# EAGLE design sonoff DIY, 3 gang(Dip version-V.1.1) (EAGLE 9.6.2)
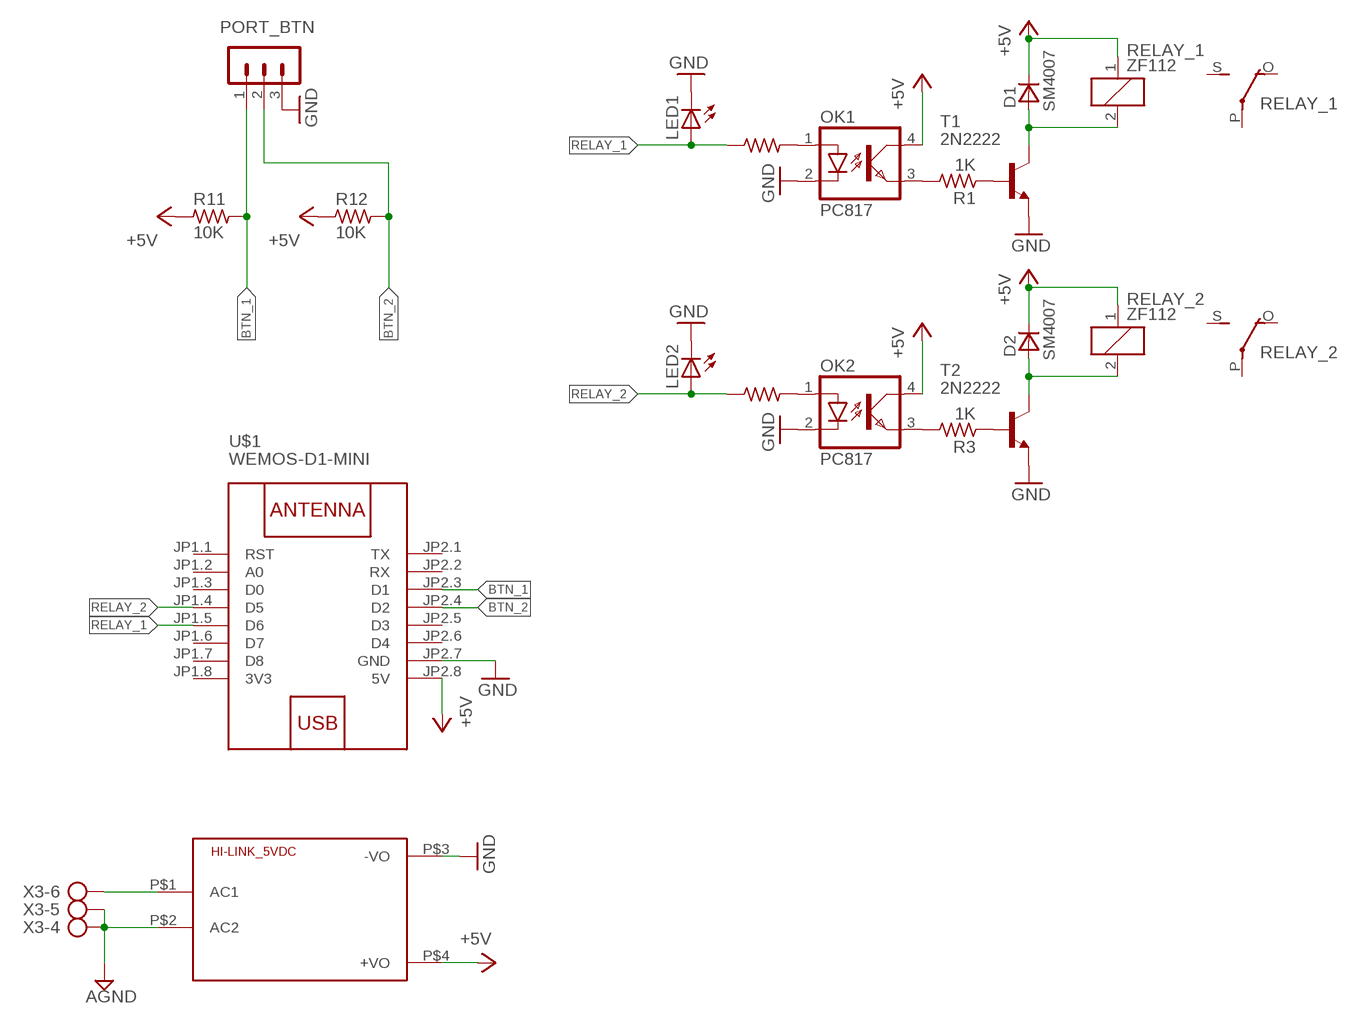
[diagram p0: schematic, sheet 1]

## Parts
D1  SM4007  [MELF-MLL41]
D2  SM4007  [MELF-MLL41]
HI-LINK_5VDC  HLK-PM013W  [HLK-PM01]
LED1  LED3MM  [LED3MM]
LED2  LED3MM  [LED3MM]
OK1  PC817  [DIL04]
OK2  PC817  [DIL04]
PORT_BTN  MA03-1  [MA03-1]
R1  1K  R_0805  [R0805]
R2  1K  R_0805  [R0805]
R3  1K  R_0805  [R0805]
R4  1K  R_0805  [R0805]
R11  10K  R_0805  [R0805]
R12  10K  R_0805  [R0805]
RELAY_1  ZF112  [ZF112]
RELAY_2  ZF112  [ZF112]
T1  2N2222  [TO18]
T2  2N2222  [TO18]
U$1  WEMOS-D1-MINI  [WEMOS-D1-MINI]
X3  SMKDSP_1,5/6  [SMKDSP_1,5/6]

## Nets
+5V: D1.C D2.C HI-LINK_5VDC.P$4(+VO) OK1.4(COL) OK2.4(COL) R11.1 R12.1 RELAY_1.1 RELAY_2.1 U$1.JP2.8(5V)
AGND: HI-LINK_5VDC.P$2(AC2) X3.4 X3.5
BTN_1: PORT_BTN.1 R11.2 U$1.JP2.3(D1)
BTN_2: PORT_BTN.2 R12.2 U$1.JP2.4(D2)
GND: HI-LINK_5VDC.P$3(-VO) LED1.K(C) LED2.K(C) OK1.2(C) OK2.2(C) PORT_BTN.3 T1.1(E) T2.1(E) U$1.JP2.7(GND)
N$1: OK1.1(A) R2.1
N$2: OK1.3(EMIT) R1.2
N$3: R1.1 T1.2(B)
N$4: D1.A RELAY_1.2 T1.3(C)
N$6: OK2.1(A) R4.1
N$7: HI-LINK_5VDC.P$1(AC1) X3.6
N$8: OK2.3(EMIT) R3.2
N$9: R3.1 T2.2(B)
N$10: D2.A RELAY_2.2 T2.3(C)
RELAY_1: LED1.A R2.2 U$1.JP1.5(D6)
RELAY_2: LED2.A R4.2 U$1.JP1.4(D5)
Unconnected: RELAY_1.O(2:O) RELAY_1.P(2:P) RELAY_1.S(2:S) RELAY_2.O(2:O) RELAY_2.P(2:P) RELAY_2.S(2:S) U$1.JP1.1(RST) U$1.JP1.2(A0) U$1.JP1.3(D0) U$1.JP1.6(D7) U$1.JP1.7(D8) U$1.JP2.1(TX) U$1.JP2.2(RX) U$1.JP2.5(D3) U$1.JP2.6(D4) X3.1 X3.2 X3.3

## Power pins joined to a net without a drawn wire
3V3: U$1.JP1.8(3V3)

## Library data of the parts
D1 D2 = _mod_diode:SM400*: SM4001 .. SM4007 General Purpose Rectifier, 1 A SMD-Version of 1N4001 .. 1N4007 Case: MELF-MLL41 = DO 213 AB Author: Dipl.-Ing. FH Rainer Bayer HHN Hochschule Heilbronn, rainer.bayer@hs-heilbronn.de Ingenieurbüro ing-rb, mail@ing-rb.de
HI-LINK_5VDC = HLK-PM01:HLK-PM01: Hi-Link Power Supply HLK-PM01 3W Author: Ahmed Said <https://github.com/AhmedSaid/EAGLELibraries>
LED1 LED2 = led:LED: LED OSRAM: - CHIPLED LG R971, LG N971, LY N971, LG Q971, LY Q971, LO R971, LY R971 LH N974, LH R974 LS Q976, LO Q976, LY Q976 LO Q996 - Hyper CHIPLED LW Q18S LB Q993, LB Q99A, LB R99A - SideLED LS A670, LO A670, LY A670, LG A670, LP A670 LB A673, LV A673, LT A673, LW A673 LH A674 LY A675 LS A676, LA A676, LO A676, LY A676, LW A676 LS A679, LY A679, LG A679 - Hyper Micro SIDELED® LS Y876, LA Y876, LO Y876, LY Y876 LT Y87S - SmartLED LW L88C, LW L88S LB L89C, LB L89S, LG L890 LS L89K, LO L89K, LY L89K LS L896, LA L896, LO L896, LY L896 - TOPLED LS T670, LO T670, LY T670, LG T670, LP T670 LSG T670, LSP T670, LSY T670, LOP T670, LYG T670 LG T671, LOG T671, LSG T671 LB T673, LV T673, LT T673, LW T673 LH T674 LS T676, LA T676, LO T676, LY T676, LB T676, LH T676, LSB T676, LW T676 LB T67C, LV T67C, LT T67C, LS T67K, LO T67K, LY T67K, LW E67C LS E67B, LA E67B, LO E67B, LY E67B, LB E67C, LV E67C, LT E67C LW T67C LS T679, LY T679, LG T679 LS T770, LO T770, LY T770, LG T770, LP T770 LB T773, LV T773, LT T773, LW T773 LH T774 LS E675, LA E675, LY E675, LS T675 LS T776, LA T776, LO T776, LY T776, LB T776 LHGB T686 LT T68C, LB T68C - Hyper Mini TOPLED® LB M676 - Mini TOPLED Santana® LG M470 LS M47K, LO M47K, LY M47K Source: http://www.osram.convergy.de LUXEON: - LUMILED® LXK2-PW12-R00, LXK2-PW12-S00, LXK2-PW14-U00, LXK2-PW14-V00 LXK2-PM12-R00, LXK2-PM12-S00, LXK2-PM14-U00 LXK2-PE12-Q00, LXK2-PE12-R00, LXK2-PE12-S00, LXK2-PE14-T00, LXK2-PE14-U00 LXK2-PB12-K00, LXK2-PB12-L00, LXK2-PB12-M00, LXK2-PB14-N00, LXK2-PB14-P00, LXK2-PB14-Q00 LXK2-PR12-L00, LXK2-PR12-M00, LXK2-PR14-Q00, LXK2-PR14-R00 LXK2-PD12-Q00, LXK2-PD12-R00, LXK2-PD12-S00 LXK2-PH12-R00, LXK2-PH12-S00 LXK2-PL12-P00, LXK2-PL12-Q00, LXK2-PL12-R00 Source: www.luxeon.com KINGBRIGHT: KA-3528ASYC Source: www.kingbright.com
OK1 OK2 = optocoupler:PC817: SHARP OPTO COUPLER; MPN: PC817X4J000F; OC_FARNELL: 9707727; OC_NEWARK: 97K7059
PORT_BTN = con-lstb:MA03-1: PIN HEADER; OC_FARNELL: unknown; OC_NEWARK: unknown
R1-R4 R11 R12 = rc-master-smd:R_: RESISTOR
RELAY_1 RELAY_2 = relay:ZF112: RELAY 1 x switch; OC_FARNELL: unknown; OC_NEWARK: unknown
T1 T2 = transistor:2N2222: NPN TRANSISTOR
U$1 = diy-modules:WEMOS-D1-MINI: WEMOS D1 mini: Mini Wi-Fi Board based on ESP-8266 device More details can be found here: https://www.wemos.cc/product/d1-mini.html Click here to find device on ebay.com <http://www.ebay.com/sch/wemos+d1+mini+nodemcu>
X3 = con-phoenix-smkdsp:SMKDSP_1,5/6: Printklemme, Nennstrom: 17,5 A, Bemessungsspannung: 250 V, Raster: 5,0 mm Source: http://eshop.phoenixcontact.de .. 1733415.pdf; MF: FARNELL; MPN: 1733619; OC_FARNELL: 3041270; OC_NEWARK: 71C4132

## Board
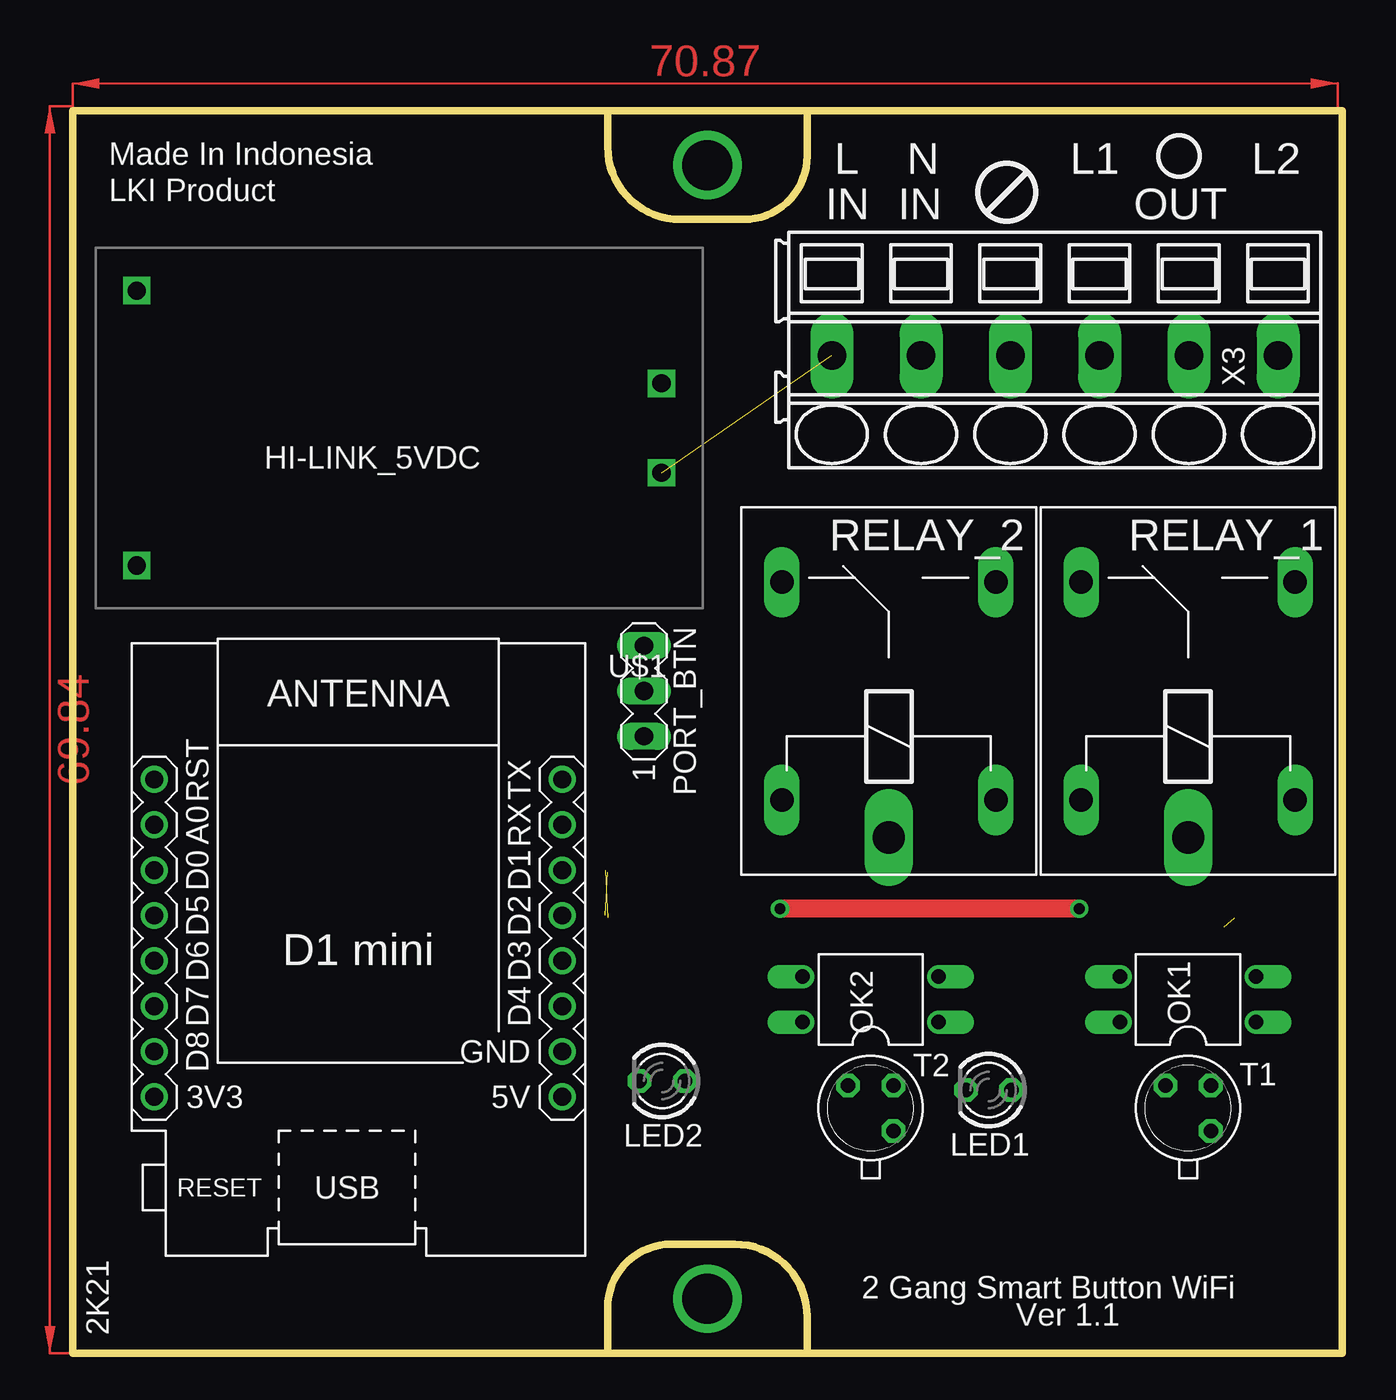
[diagram p1: board, top side]
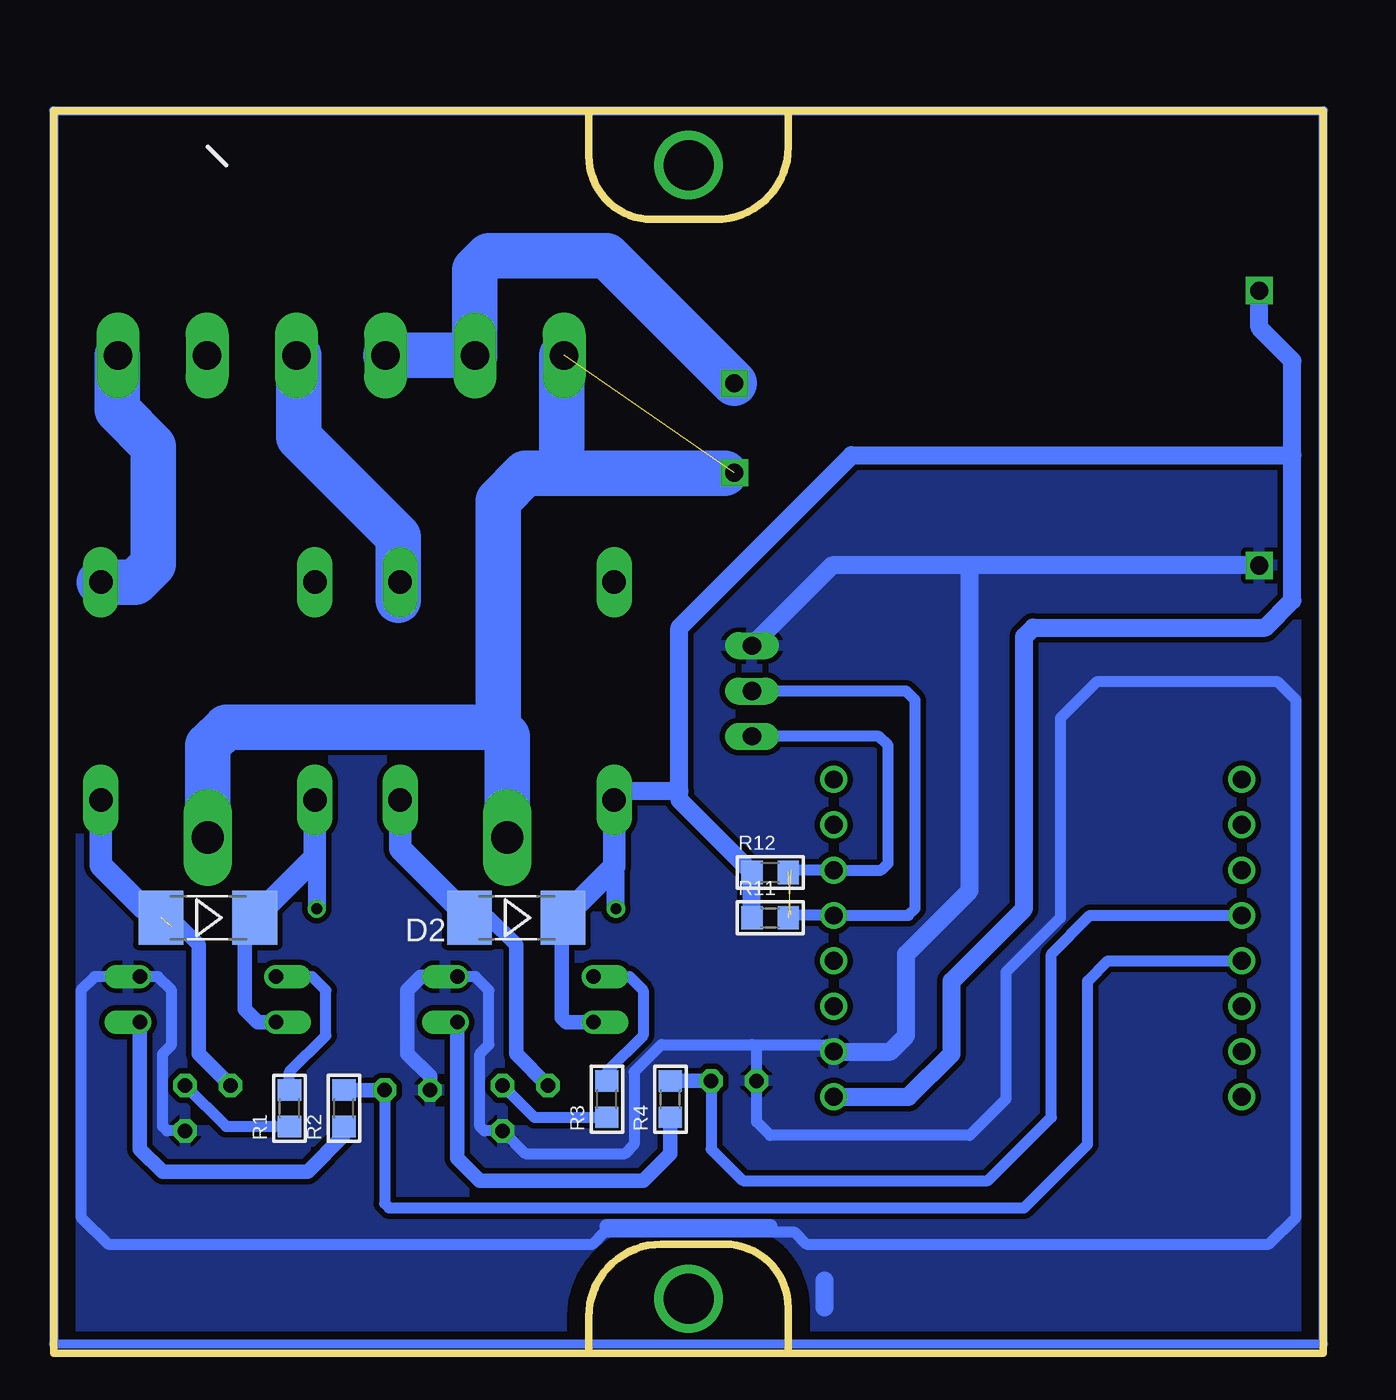
[diagram p2: board, bottom side, seen from below]

Size 71.12 x 69.6 mm. Coordinates in mm from the lower left corner, seen from the top.
Outline: 29.97,69.6 0,69.6 0,0 29.97,0
Outline: 29.97,69.6 29.97,67.56 arc90 34.04,63.5 37.59,63.5 arc90 41.15,67.06 41.15,69.6
Outline: 41.15,69.6 71.12,69.6 71.12,0 41.15,0
Outline: 41.15,0 41.15,2.03 arc90 37.08,6.1 33.53,6.1 arc90 29.97,2.54 29.97,0
Outline: 29.97,69.6 41.15,69.6
Outline: 29.97,0 41.15,0
Copper layers (1*16): Top 0.035mm / dielectric 1.5mm / Bottom 0.035mm
Design rules "default": minimum track width 10mil, minimum drill 24mil, track to track 8mil, track to pad 8mil, pad to pad 8mil, via to via 8mil, smd to smd 8mil, copper to edge 40mil, drill to drill 8mil, minimum pad ring 10mil, minimum via ring 8mil, stop-mask expansion 4mil, vias tented up to drill 0mil, thermal gap 10mil

### Footprints (pad centres in the part's own frame; a part is rotated, then mirrored left to right if it is on the bottom)
MELF-MLL41 = smd 2.5 x 3: A 2.625,0; C -2.625,0
HLK-PM01 = drill 1.016 square: P$1 -14.7,2.5; P$2 -14.7,-2.5; P$3 14.7,7.7; P$4 14.7,-7.7
LED3MM = drill 0.813 octagon: A -1.27,0; K 1.27,0
DIL04 = drill 0.813 offset: 1 -1.27,-3.81; 2 1.27,-3.81; 3 1.27,3.81; 4 -1.27,3.81
MA03-1 = drill 1.016 long: 1 -2.54,0; 2 0,0; 3 2.54,0
R0805 = smd 1.2 x 1.3: 1 -1.016,0; 2 1.016,0
ZF112 = drill 1.321 long: 1 -6.096,5.994; 2 -6.096,-5.994; O 6.096,5.994; S 6.096,-5.994 | drill 1.803 long: P -8.204,0
TO18 = drill 0.813 octagon: 1 -1.27,-1.27; 2 1.27,-1.27; 3 1.27,1.27
WEMOS-D1-MINI = drill 1: JP1.1 -11.43,9.525; JP1.2 -11.43,6.985; JP1.3 -11.43,4.445; JP1.4 -11.43,1.905; JP1.5 -11.43,-0.635; JP1.6 -11.43,-3.175; JP1.7 -11.43,-5.715; JP1.8 -11.43,-8.255; JP2.1 11.43,9.525; JP2.2 11.43,6.985; JP2.3 11.43,4.445; JP2.4 11.43,1.905; JP2.5 11.43,-0.635; JP2.6 11.43,-3.175; JP2.7 11.43,-5.715; JP2.8 11.43,-8.255
SMKDSP_1,5/6 = drill 1.6 pad 1.8 long: 1 -2.5,0; 2 2.5,0; 3 7.5,0; 4 12.5,0; 5 17.5,0; 6 22.5,0

### Placement (x,y rotation side)
D1  62.48,24.38 180 bottom
D2  45.21,24.38 180 bottom
HI-LINK_5VDC  18.29,51.82 180 top
LED1  51.31,14.73 180 top
LED2  33.02,15.24 180 top
OK1  62.48,19.81 90 top
OK2  44.7,19.81 90 top
PORT_BTN  32,37.08 90 top
R1  57.91,13.72 90 bottom
R2  54.86,13.72 90 bottom
R3  40.13,14.22 90 bottom
R4  36.58,14.22 90 bottom
R11  30.99,24.38 0 bottom
R12  30.99,26.92 0 bottom
RELAY_1  62.48,37.08 90 top
RELAY_2  45.72,37.08 90 top
T1  62.48,13.72 90 top
T2  44.7,13.72 90 top
U$1  16,22.61 0 top
X3  65.02,55.88 180 top

### Tracks (layer width: path | path; a pad name or v marks a point on that pad's centre or on a via)
+5V  (via drill 0.61)
  Top 1.016: v56.39,24.89 v39.62,24.89
  Bottom 0.813: 60.45,23.79 60.41,23.83 | 60.41,23.83 D1.C 59.94,24.38 | OK1.4 59.69,18.54 60.41,19.26 60.41,23.83 | OK2.4 42.42,18.54 42.67,18.8 42.67,24.3 D2.C
  Bottom 1.016: U$1.JP2.8 23.24,14.35 20.83,16.76 20.83,20.83 16.76,24.89 16.76,40.13 16.26,40.64 3.25,40.64 1.73,42.16 1.73,50.29 | 1.73,50.29 1.73,55.58 3.59,57.44 HI-LINK_5VDC.P$4 | R11.1 R12.1 36.07,30.99 36.07,31.5 | 36.07,31.5 36.07,40.64 26.42,50.29 1.73,50.29 | RELAY_2.1 39.22,31.5 36.07,31.5 | RELAY_1.1 56.49,28.45 56.39,28.35 v56.39,24.89 | v39.62,24.89 39.62,27.14 39.73,27.25
  Bottom 1.27: RELAY_1.1 56.49,27.75 D1.C | RELAY_2.1 39.73,27.25 D2.C
AGND
  Bottom 2.54: HI-LINK_5VDC.P$2 40.14,61.47 46.74,61.47 47.52,60.68 X3.5 X3.4
BTN_1  (1 unrouted)
  Bottom 0.61: 29.84,27.05 U$1.JP2.3 24.77,27.05 24.38,27.43 24.38,34.04 24.89,34.54 PORT_BTN.1
BTN_2  (1 unrouted)
  Bottom 0.61: 29.84,24.51 U$1.JP2.4 23.24,24.51 22.86,24.89 22.86,36.58 23.37,37.08 PORT_BTN.2
GND
  Bottom 0.61: T1.1 64.77,12.45 65.02,12.7 65.02,16.76 64.52,17.27 64.52,20.32 65.28,21.08 OK1.2 68.83,21.08 69.6,20.32 69.6,7.62 68.07,6.1 40.93,6.1 40.24,6.79 29.65,6.79 28.96,6.1 3.05,6.1 1.52,7.62 1.52,36.58 2.54,37.59 12.7,37.59 14.73,35.56 14.73,24.38 17.78,21.34 17.78,14.22 19.81,12.19 30.99,12.19 31.75,12.95 LED2.K 31.75,17.02 32,17.27 | OK2.2 47.5,21.08 46.74,20.32 46.74,17.27 47.24,16.76 47.24,12.7 46.99,12.45 T2.1 44.7,11.18 39.12,11.18 38.61,11.68 38.61,15.75 37.08,17.27 32,17.27 | 32,17.27 27.81,17.27 U$1.JP2.7
  Bottom 0.813: LED1.K 50.04,15.49 51.31,16.76 51.31,20.32 50.55,21.08 OK2.2 | 30.99,7.11 40.13,7.11
  Bottom 1.016: HI-LINK_5VDC.P$3 19.81,44.12 | 19.81,44.12 27.51,44.12 PORT_BTN.3 | U$1.JP2.7 24.26,16.89 23.37,17.78 23.37,21.84 23.37,22.35 19.81,25.91 19.81,44.12 | 27.94,2.54 27.94,4.06
  pour Bottom (isolate 0.305): 0,69.6 71.12,69.6 71.12,0 0,0
N$1
  Bottom 0.813: OK1.1 66.29,11.43 65.02,10.16 56.9,10.16 54.86,12.19 R2.1
N$2
  Bottom 0.61: R1.2 57.91,15.75 55.88,17.78 55.88,20.32 56.64,21.08 OK1.3
N$3
  Bottom 0.61: T1.2 61.47,12.7 R1.1
N$4  (1 unrouted)
  Bottom 0.813: 64.52,23.88 65.02,23.88 | T1.3 62.99,16.76 62.99,22.86 65.02,24.89 66.04,24.89
  Bottom 1.27: RELAY_1.2 68.48,27.33 66.04,24.89 65.02,23.88
N$5
  Bottom 2.54: 45.72,27.43 45.72,34.54 46.23,35.05 61.47,35.05 62.48,34.04 62.48,27.43
N$6
  Bottom 0.813: OK2.1 48.51,10.92 47.24,9.65 38.1,9.65 36.58,11.18 R4.1
N$7  (1 unrouted)
N$8
  Bottom 0.61: R3.2 40.13,15.75 38.1,17.78 38.1,20.32 38.86,21.08 OK2.3
N$9
  Bottom 0.61: T2.2 44.2,13.21 R3.1
N$10
  Bottom 0.61: D2.A 47.75,24.47 47.75,24.89
  Bottom 0.813: T2.3 45.21,16.76 45.21,22.86 46.74,24.38 D2.A
  Bottom 1.27: RELAY_2.2 51.71,28.26 D2.A
N$11
  Bottom 2.54: 46.23,35.56 46.23,47.75 44.7,49.28 42.67,49.28 | 33.53,49.28 42.67,49.28 | 42.67,55.88 42.67,49.28
N$13
  Bottom 2.54: 68.58,43.18 66.55,43.18 65.53,44.2 65.53,50.8 67.56,52.83 67.56,55.88
N$14
  Bottom 2.54: 51.82,42.16 51.82,45.72 57.4,51.31 57.4,55.88
N$21  (via drill 2.8 pad 1.27)
  other vias: 35.56,66.55
N$28  (via drill 2.8 pad 1.27)
  other vias: 35.56,3.05
N$30
  Bottom 0.508: 71.12,69.6 0,69.6 0,0.51 71.12,0.51 71.12,69.6
RELAY_1
  Bottom 0.61: LED1.A 52.58,8.38 52.32,8.13 16.76,8.13 13.21,11.68 13.21,20.83 12.06,21.97 U$1.JP1.5
  Bottom 0.813: LED1.A R2.2
RELAY_2
  Bottom 0.61: LED2.A 34.29,11.43 32.51,9.65 18.8,9.65 15.24,13.21 15.24,22.35 13.08,24.51 U$1.JP1.4
  Bottom 0.813: LED2.A R4.2
(copper drawn outside any net)
  shapes: Top area x2

### Text on the board
tNames: Made In Indonesia | L | N | L1 | L2 | LKI Product | IN | IN | OUT | 2 Gang Smart Button WiFi | Ver 1.1 | 2K21